# EAGLE design Smart Light Panel (EAGLE 7.5.0)
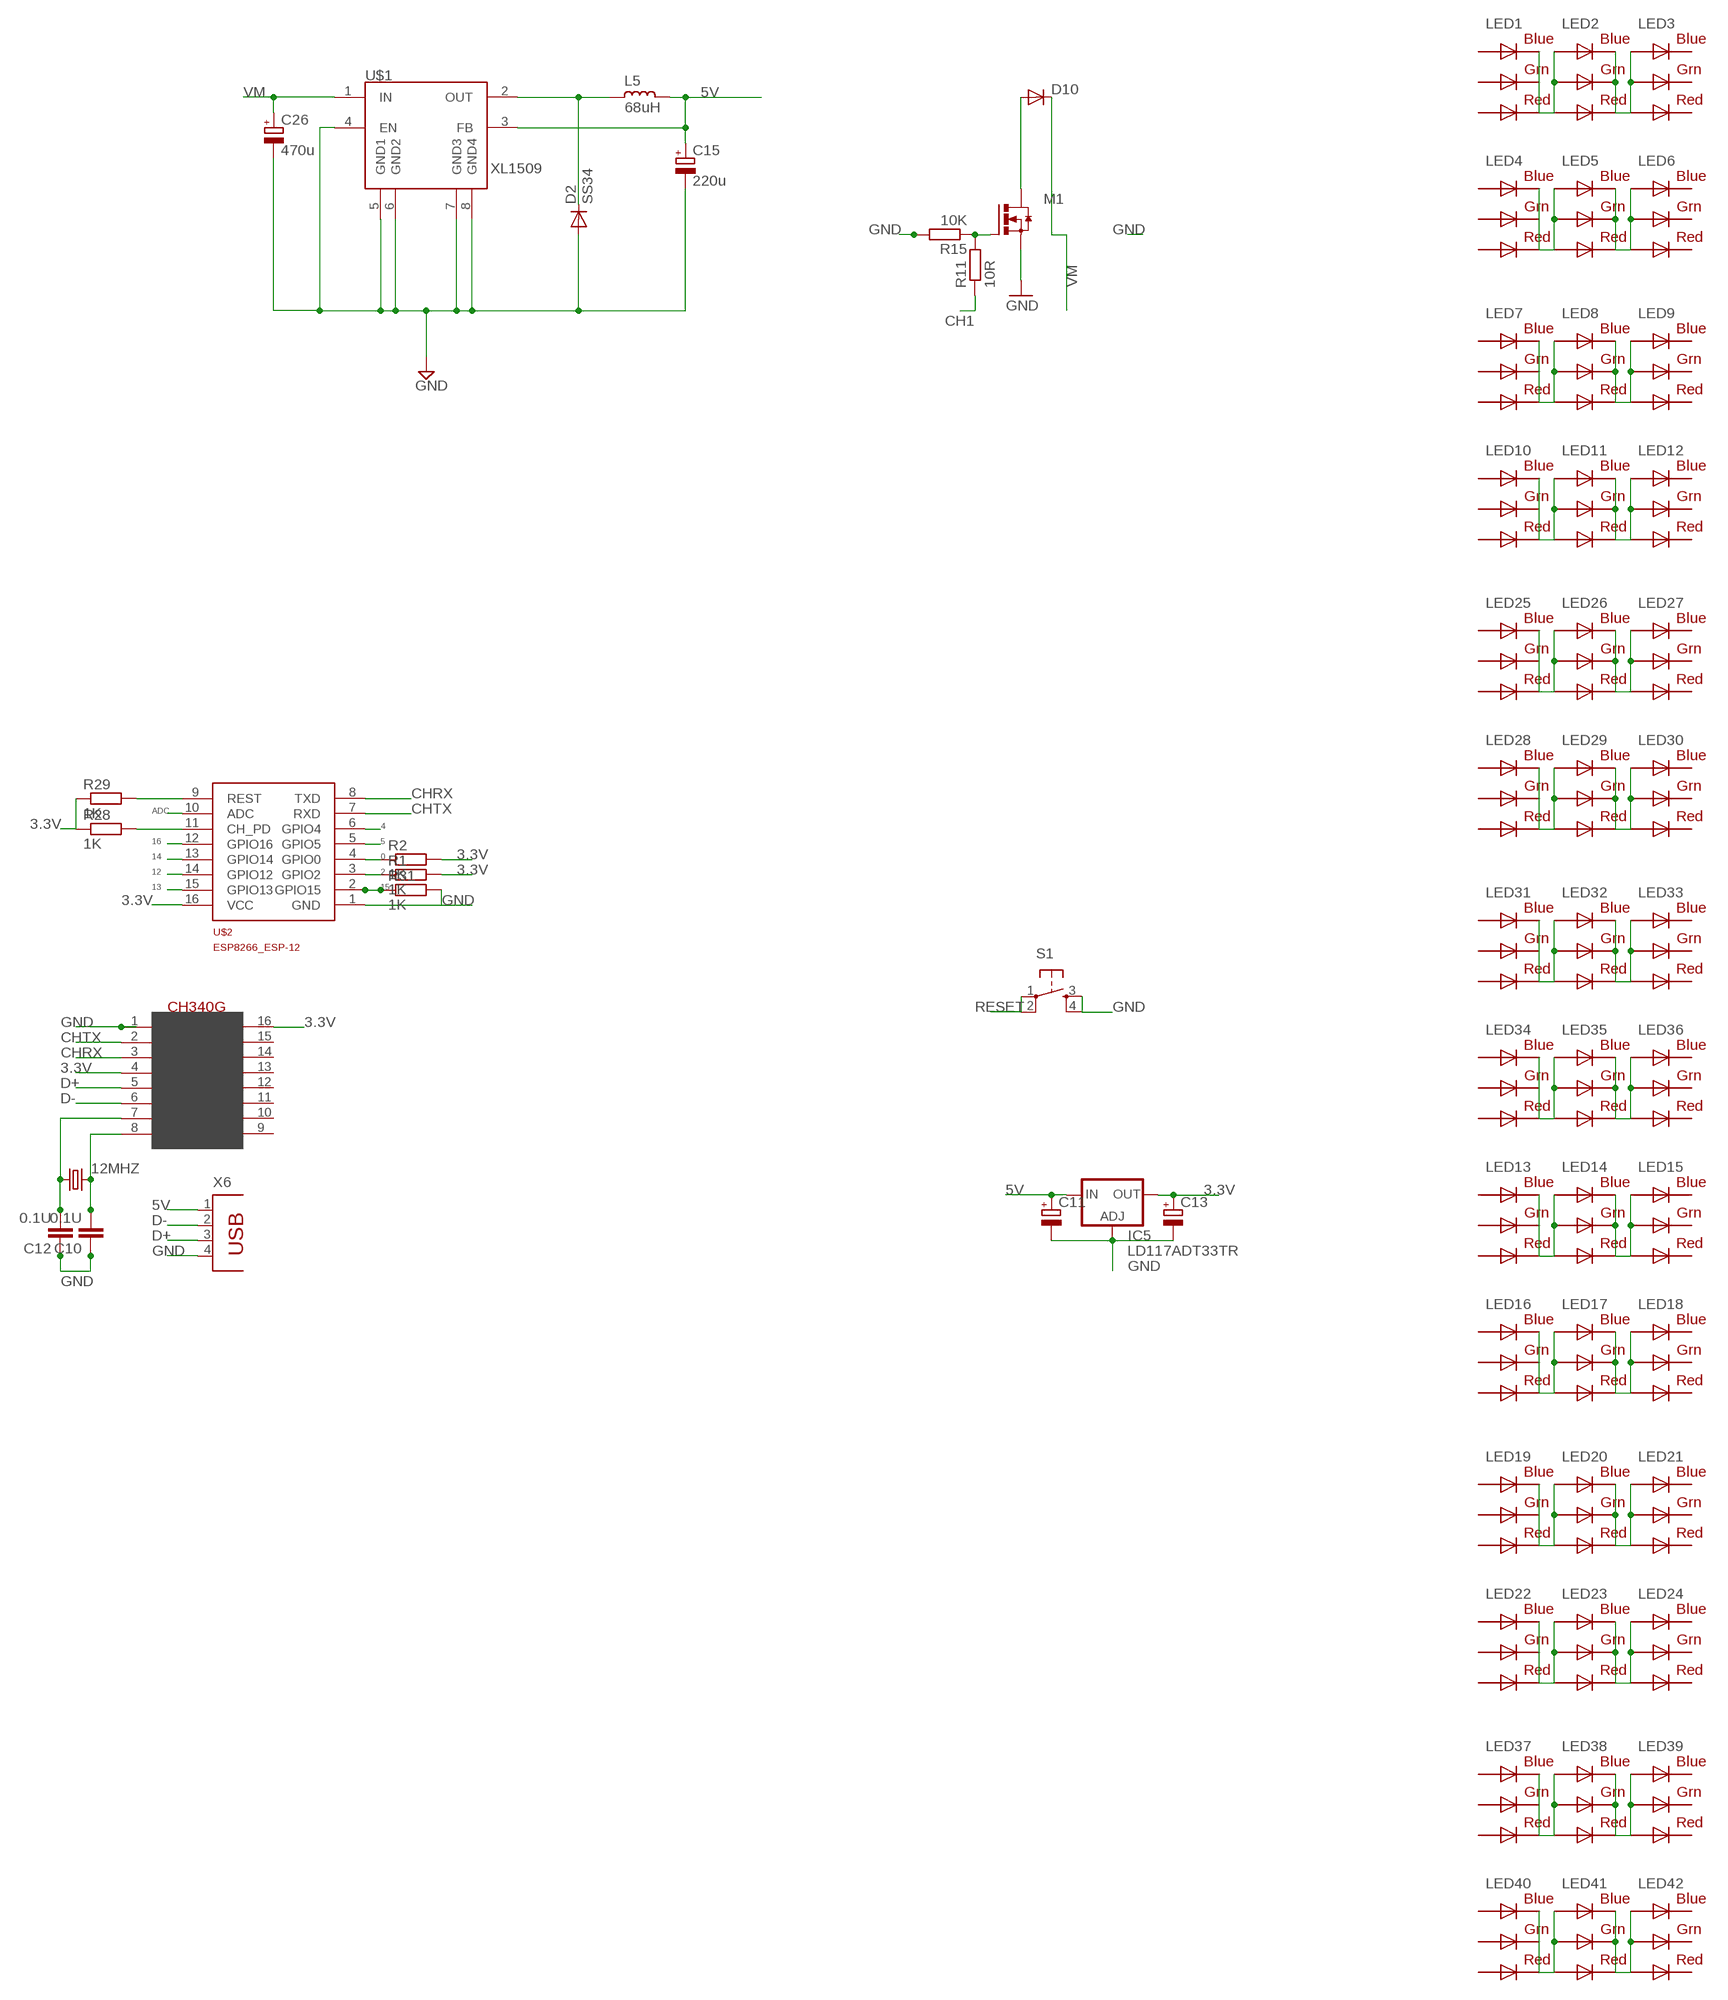
[diagram p0: schematic, sheet 1, part 1 of 2]
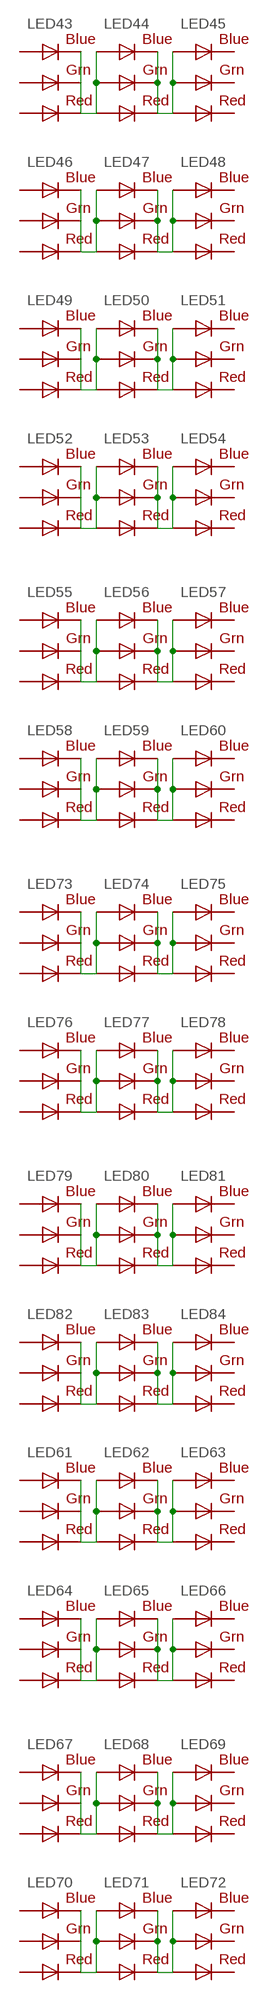
[diagram p1: schematic, sheet 1, part 2 of 2]

## Parts
12MHZ  CRYSTALHC49UP  [HC49UP]
C10  0.1U  C-EUC1206  [C1206]
C11  CPOL-EUC  [PANASONIC_C]
C12  0.1U  C-EUC1206  [C1206]
C13  CPOL-EUC  [PANASONIC_C]
C15  220u  CPOL-EUE2.5-7  [E2,5-7]
C26  470u  CPOL-EUE2.5-7  [E2,5-7]
D2  SS34  DIODE-DO-214AC  [DO-214AC]
D10  DIODESMA-ALT  [SMA-DIODE_ALT]
IC5  LD117ADT33TR  [DPACK]
L5  68uH  L_CD75  [CD75]
LED1  RGBLED5050  [RGBLED5050]
LED2  RGBLED5050  [RGBLED5050]
LED3  RGBLED5050  [RGBLED5050]
LED4  RGBLED5050  [RGBLED5050]
LED5  RGBLED5050  [RGBLED5050]
LED6  RGBLED5050  [RGBLED5050]
LED7  RGBLED5050  [RGBLED5050]
LED8  RGBLED5050  [RGBLED5050]
LED9  RGBLED5050  [RGBLED5050]
LED10  RGBLED5050  [RGBLED5050]
LED11  RGBLED5050  [RGBLED5050]
LED12  RGBLED5050  [RGBLED5050]
LED13  RGBLED5050  [RGBLED5050]
LED14  RGBLED5050  [RGBLED5050]
LED15  RGBLED5050  [RGBLED5050]
LED16  RGBLED5050  [RGBLED5050]
LED17  RGBLED5050  [RGBLED5050]
LED18  RGBLED5050  [RGBLED5050]
LED19  RGBLED5050  [RGBLED5050]
LED20  RGBLED5050  [RGBLED5050]
LED21  RGBLED5050  [RGBLED5050]
LED22  RGBLED5050  [RGBLED5050]
LED23  RGBLED5050  [RGBLED5050]
LED24  RGBLED5050  [RGBLED5050]
LED25  RGBLED5050  [RGBLED5050]
LED26  RGBLED5050  [RGBLED5050]
LED27  RGBLED5050  [RGBLED5050]
LED28  RGBLED5050  [RGBLED5050]
LED29  RGBLED5050  [RGBLED5050]
LED30  RGBLED5050  [RGBLED5050]
LED31  RGBLED5050  [RGBLED5050]
LED32  RGBLED5050  [RGBLED5050]
LED33  RGBLED5050  [RGBLED5050]
LED34  RGBLED5050  [RGBLED5050]
LED35  RGBLED5050  [RGBLED5050]
LED36  RGBLED5050  [RGBLED5050]
LED37  RGBLED5050  [RGBLED5050]
LED38  RGBLED5050  [RGBLED5050]
LED39  RGBLED5050  [RGBLED5050]
LED40  RGBLED5050  [RGBLED5050]
LED41  RGBLED5050  [RGBLED5050]
LED42  RGBLED5050  [RGBLED5050]
LED43  RGBLED5050  [RGBLED5050]
LED44  RGBLED5050  [RGBLED5050]
LED45  RGBLED5050  [RGBLED5050]
LED46  RGBLED5050  [RGBLED5050]
LED47  RGBLED5050  [RGBLED5050]
LED48  RGBLED5050  [RGBLED5050]
LED49  RGBLED5050  [RGBLED5050]
LED50  RGBLED5050  [RGBLED5050]
LED51  RGBLED5050  [RGBLED5050]
LED52  RGBLED5050  [RGBLED5050]
LED53  RGBLED5050  [RGBLED5050]
LED54  RGBLED5050  [RGBLED5050]
LED55  RGBLED5050  [RGBLED5050]
LED56  RGBLED5050  [RGBLED5050]
LED57  RGBLED5050  [RGBLED5050]
LED58  RGBLED5050  [RGBLED5050]
LED59  RGBLED5050  [RGBLED5050]
LED60  RGBLED5050  [RGBLED5050]
LED61  RGBLED5050  [RGBLED5050]
LED62  RGBLED5050  [RGBLED5050]
LED63  RGBLED5050  [RGBLED5050]
LED64  RGBLED5050  [RGBLED5050]
LED65  RGBLED5050  [RGBLED5050]
LED66  RGBLED5050  [RGBLED5050]
LED67  RGBLED5050  [RGBLED5050]
LED68  RGBLED5050  [RGBLED5050]
LED69  RGBLED5050  [RGBLED5050]
LED70  RGBLED5050  [RGBLED5050]
LED71  RGBLED5050  [RGBLED5050]
LED72  RGBLED5050  [RGBLED5050]
LED73  RGBLED5050  [RGBLED5050]
LED74  RGBLED5050  [RGBLED5050]
LED75  RGBLED5050  [RGBLED5050]
LED76  RGBLED5050  [RGBLED5050]
LED77  RGBLED5050  [RGBLED5050]
LED78  RGBLED5050  [RGBLED5050]
LED79  RGBLED5050  [RGBLED5050]
LED80  RGBLED5050  [RGBLED5050]
LED81  RGBLED5050  [RGBLED5050]
LED82  RGBLED5050  [RGBLED5050]
LED83  RGBLED5050  [RGBLED5050]
LED84  RGBLED5050  [RGBLED5050]
M1  IRLR024N  [TO252]
R1  1K  R-EU_M1206  [M1206]
R2  1K  R-EU_M1206  [M1206]
R11  10R  R-EU_M1206  [M1206]
R15  10K  R-EU_M1206  [M1206]
R28  1K  R-EU_M1206  [M1206]
R29  1K  R-EU_M1206  [M1206]
R31  1K  R-EU_M1206  [M1206]
S1  TAC_SWITCHPTH  [TACTILE-PTH]
U$1  XL1509  [SO08]
U$2  ESP8266_ESP-12  [ESP8266-ESP12]
U$4  CH340G  [SOIC16]
X6  PN61729  [PN61729]

## Nets
0: R2.1 U$2.4(GPIO0)
2: R1.1 U$2.3(GPIO2)
3.3V: C13.+ IC5.4(OUT) R1.2 R2.2 R28.1 R29.1 U$2.16(VCC) U$4.4(V3) U$4.16(VCC)
4: U$2.6(GPIO4)
5: U$2.5(GPIO5)
5V: C11.+ C15.+ IC5.3(IN) L5.1 U$1.3(FB) X6.1
12: U$2.14(GPIO12)
13: U$2.15(GPIO13)
14: U$2.13(GPIO14)
15: R31.1 U$2.2(GPIO15)
16: U$2.12(GPIO16)
ADC: U$2.10(ADC)
CH1: R11.1
CHRX: U$2.8(TXD) U$4.3(RX)
CHTX: U$2.7(RXD) U$4.2(TX)
D+: U$4.5(D+) X6.3
D-: U$4.6(D-) X6.2
GND: C10.1 C11.- C12.1 C13.- C15.- C26.- D2.2(A) IC5.1(ADJ) M1.2(S) R15.2 R31.2 S1.3 S1.4 U$1.4(EN) U$1.5(GND1) U$1.6(GND2) U$1.7(GND3) U$1.8(GND4) U$2.1(GND) U$4.1(GND) X6.4
MOSFET: D10.A M1.3(D)
N$2: LED1.4(BLUE_C) LED1.5(RED_C) LED1.6(GREEN_C) LED2.1(GREEN_A) LED2.2(RED_A) LED2.3(BLUE_A)
N$3: LED2.4(BLUE_C) LED2.5(RED_C) LED2.6(GREEN_C) LED3.1(GREEN_A) LED3.2(RED_A) LED3.3(BLUE_A)
N$6: LED4.4(BLUE_C) LED4.5(RED_C) LED4.6(GREEN_C) LED5.1(GREEN_A) LED5.2(RED_A) LED5.3(BLUE_A)
N$7: LED5.4(BLUE_C) LED5.5(RED_C) LED5.6(GREEN_C) LED6.1(GREEN_A) LED6.2(RED_A) LED6.3(BLUE_A)
N$11: LED7.4(BLUE_C) LED7.5(RED_C) LED7.6(GREEN_C) LED8.1(GREEN_A) LED8.2(RED_A) LED8.3(BLUE_A)
N$12: 12MHZ.1 C12.2 U$4.7(XI)
N$13: 12MHZ.2 C10.2 U$4.8(XO)
N$14: LED8.4(BLUE_C) LED8.5(RED_C) LED8.6(GREEN_C) LED9.1(GREEN_A) LED9.2(RED_A) LED9.3(BLUE_A)
N$16: LED10.4(BLUE_C) LED10.5(RED_C) LED10.6(GREEN_C) LED11.1(GREEN_A) LED11.2(RED_A) LED11.3(BLUE_A)
N$17: LED11.4(BLUE_C) LED11.5(RED_C) LED11.6(GREEN_C) LED12.1(GREEN_A) LED12.2(RED_A) LED12.3(BLUE_A)
N$18: R28.2 U$2.11(CH_PD)
N$20: LED13.4(BLUE_C) LED13.5(RED_C) LED13.6(GREEN_C) LED14.1(GREEN_A) LED14.2(RED_A) LED14.3(BLUE_A)
N$21: LED14.4(BLUE_C) LED14.5(RED_C) LED14.6(GREEN_C) LED15.1(GREEN_A) LED15.2(RED_A) LED15.3(BLUE_A)
N$23: LED16.4(BLUE_C) LED16.5(RED_C) LED16.6(GREEN_C) LED17.1(GREEN_A) LED17.2(RED_A) LED17.3(BLUE_A)
N$24: LED17.4(BLUE_C) LED17.5(RED_C) LED17.6(GREEN_C) LED18.1(GREEN_A) LED18.2(RED_A) LED18.3(BLUE_A)
N$26: LED19.4(BLUE_C) LED19.5(RED_C) LED19.6(GREEN_C) LED20.1(GREEN_A) LED20.2(RED_A) LED20.3(BLUE_A)
N$27: LED20.4(BLUE_C) LED20.5(RED_C) LED20.6(GREEN_C) LED21.1(GREEN_A) LED21.2(RED_A) LED21.3(BLUE_A)
N$29: LED22.4(BLUE_C) LED22.5(RED_C) LED22.6(GREEN_C) LED23.1(GREEN_A) LED23.2(RED_A) LED23.3(BLUE_A)
N$30: LED23.4(BLUE_C) LED23.5(RED_C) LED23.6(GREEN_C) LED24.1(GREEN_A) LED24.2(RED_A) LED24.3(BLUE_A)
N$32: LED25.4(BLUE_C) LED25.5(RED_C) LED25.6(GREEN_C) LED26.1(GREEN_A) LED26.2(RED_A) LED26.3(BLUE_A)
N$33: LED26.4(BLUE_C) LED26.5(RED_C) LED26.6(GREEN_C) LED27.1(GREEN_A) LED27.2(RED_A) LED27.3(BLUE_A)
N$35: LED28.4(BLUE_C) LED28.5(RED_C) LED28.6(GREEN_C) LED29.1(GREEN_A) LED29.2(RED_A) LED29.3(BLUE_A)
N$36: LED29.4(BLUE_C) LED29.5(RED_C) LED29.6(GREEN_C) LED30.1(GREEN_A) LED30.2(RED_A) LED30.3(BLUE_A)
N$38: LED31.4(BLUE_C) LED31.5(RED_C) LED31.6(GREEN_C) LED32.1(GREEN_A) LED32.2(RED_A) LED32.3(BLUE_A)
N$39: LED32.4(BLUE_C) LED32.5(RED_C) LED32.6(GREEN_C) LED33.1(GREEN_A) LED33.2(RED_A) LED33.3(BLUE_A)
N$41: LED34.4(BLUE_C) LED34.5(RED_C) LED34.6(GREEN_C) LED35.1(GREEN_A) LED35.2(RED_A) LED35.3(BLUE_A)
N$42: LED35.4(BLUE_C) LED35.5(RED_C) LED35.6(GREEN_C) LED36.1(GREEN_A) LED36.2(RED_A) LED36.3(BLUE_A)
N$44: LED37.4(BLUE_C) LED37.5(RED_C) LED37.6(GREEN_C) LED38.1(GREEN_A) LED38.2(RED_A) LED38.3(BLUE_A)
N$45: LED38.4(BLUE_C) LED38.5(RED_C) LED38.6(GREEN_C) LED39.1(GREEN_A) LED39.2(RED_A) LED39.3(BLUE_A)
N$47: LED40.4(BLUE_C) LED40.5(RED_C) LED40.6(GREEN_C) LED41.1(GREEN_A) LED41.2(RED_A) LED41.3(BLUE_A)
N$48: LED41.4(BLUE_C) LED41.5(RED_C) LED41.6(GREEN_C) LED42.1(GREEN_A) LED42.2(RED_A) LED42.3(BLUE_A)
N$50: LED43.4(BLUE_C) LED43.5(RED_C) LED43.6(GREEN_C) LED44.1(GREEN_A) LED44.2(RED_A) LED44.3(BLUE_A)
N$51: LED44.4(BLUE_C) LED44.5(RED_C) LED44.6(GREEN_C) LED45.1(GREEN_A) LED45.2(RED_A) LED45.3(BLUE_A)
N$53: LED46.4(BLUE_C) LED46.5(RED_C) LED46.6(GREEN_C) LED47.1(GREEN_A) LED47.2(RED_A) LED47.3(BLUE_A)
N$54: LED47.4(BLUE_C) LED47.5(RED_C) LED47.6(GREEN_C) LED48.1(GREEN_A) LED48.2(RED_A) LED48.3(BLUE_A)
N$56: LED49.4(BLUE_C) LED49.5(RED_C) LED49.6(GREEN_C) LED50.1(GREEN_A) LED50.2(RED_A) LED50.3(BLUE_A)
N$57: LED50.4(BLUE_C) LED50.5(RED_C) LED50.6(GREEN_C) LED51.1(GREEN_A) LED51.2(RED_A) LED51.3(BLUE_A)
N$59: LED52.4(BLUE_C) LED52.5(RED_C) LED52.6(GREEN_C) LED53.1(GREEN_A) LED53.2(RED_A) LED53.3(BLUE_A)
N$60: LED53.4(BLUE_C) LED53.5(RED_C) LED53.6(GREEN_C) LED54.1(GREEN_A) LED54.2(RED_A) LED54.3(BLUE_A)
N$62: LED55.4(BLUE_C) LED55.5(RED_C) LED55.6(GREEN_C) LED56.1(GREEN_A) LED56.2(RED_A) LED56.3(BLUE_A)
N$63: LED56.4(BLUE_C) LED56.5(RED_C) LED56.6(GREEN_C) LED57.1(GREEN_A) LED57.2(RED_A) LED57.3(BLUE_A)
N$65: LED58.4(BLUE_C) LED58.5(RED_C) LED58.6(GREEN_C) LED59.1(GREEN_A) LED59.2(RED_A) LED59.3(BLUE_A)
N$66: LED59.4(BLUE_C) LED59.5(RED_C) LED59.6(GREEN_C) LED60.1(GREEN_A) LED60.2(RED_A) LED60.3(BLUE_A)
N$67: M1.1(G) R11.2 R15.1
N$69: LED61.4(BLUE_C) LED61.5(RED_C) LED61.6(GREEN_C) LED62.1(GREEN_A) LED62.2(RED_A) LED62.3(BLUE_A)
N$70: LED62.4(BLUE_C) LED62.5(RED_C) LED62.6(GREEN_C) LED63.1(GREEN_A) LED63.2(RED_A) LED63.3(BLUE_A)
N$72: LED64.4(BLUE_C) LED64.5(RED_C) LED64.6(GREEN_C) LED65.1(GREEN_A) LED65.2(RED_A) LED65.3(BLUE_A)
N$73: LED65.4(BLUE_C) LED65.5(RED_C) LED65.6(GREEN_C) LED66.1(GREEN_A) LED66.2(RED_A) LED66.3(BLUE_A)
N$75: LED67.4(BLUE_C) LED67.5(RED_C) LED67.6(GREEN_C) LED68.1(GREEN_A) LED68.2(RED_A) LED68.3(BLUE_A)
N$76: LED68.4(BLUE_C) LED68.5(RED_C) LED68.6(GREEN_C) LED69.1(GREEN_A) LED69.2(RED_A) LED69.3(BLUE_A)
N$78: LED70.4(BLUE_C) LED70.5(RED_C) LED70.6(GREEN_C) LED71.1(GREEN_A) LED71.2(RED_A) LED71.3(BLUE_A)
N$79: LED71.4(BLUE_C) LED71.5(RED_C) LED71.6(GREEN_C) LED72.1(GREEN_A) LED72.2(RED_A) LED72.3(BLUE_A)
N$81: LED73.4(BLUE_C) LED73.5(RED_C) LED73.6(GREEN_C) LED74.1(GREEN_A) LED74.2(RED_A) LED74.3(BLUE_A)
N$82: LED74.4(BLUE_C) LED74.5(RED_C) LED74.6(GREEN_C) LED75.1(GREEN_A) LED75.2(RED_A) LED75.3(BLUE_A)
N$84: LED76.4(BLUE_C) LED76.5(RED_C) LED76.6(GREEN_C) LED77.1(GREEN_A) LED77.2(RED_A) LED77.3(BLUE_A)
N$85: LED77.4(BLUE_C) LED77.5(RED_C) LED77.6(GREEN_C) LED78.1(GREEN_A) LED78.2(RED_A) LED78.3(BLUE_A)
N$87: LED79.4(BLUE_C) LED79.5(RED_C) LED79.6(GREEN_C) LED80.1(GREEN_A) LED80.2(RED_A) LED80.3(BLUE_A)
N$88: LED80.4(BLUE_C) LED80.5(RED_C) LED80.6(GREEN_C) LED81.1(GREEN_A) LED81.2(RED_A) LED81.3(BLUE_A)
N$90: LED82.4(BLUE_C) LED82.5(RED_C) LED82.6(GREEN_C) LED83.1(GREEN_A) LED83.2(RED_A) LED83.3(BLUE_A)
N$91: LED83.4(BLUE_C) LED83.5(RED_C) LED83.6(GREEN_C) LED84.1(GREEN_A) LED84.2(RED_A) LED84.3(BLUE_A)
N$92: D2.1(C) L5.2 U$1.2(OUT)
RESET: R29.2 S1.1 S1.2 U$2.9(REST)
VM: C26.+ D10.C U$1.1(IN)
Unconnected: LED1.1(GREEN_A) LED1.2(RED_A) LED1.3(BLUE_A) LED3.4(BLUE_C) LED3.5(RED_C) LED3.6(GREEN_C) LED4.1(GREEN_A) LED4.2(RED_A) LED4.3(BLUE_A) LED6.4(BLUE_C) LED6.5(RED_C) LED6.6(GREEN_C) LED7.1(GREEN_A) LED7.2(RED_A) LED7.3(BLUE_A) LED9.4(BLUE_C) LED9.5(RED_C) LED9.6(GREEN_C) LED10.1(GREEN_A) LED10.2(RED_A) LED10.3(BLUE_A) LED12.4(BLUE_C) LED12.5(RED_C) LED12.6(GREEN_C) LED13.1(GREEN_A) LED13.2(RED_A) LED13.3(BLUE_A) LED15.4(BLUE_C) LED15.5(RED_C) LED15.6(GREEN_C) LED16.1(GREEN_A) LED16.2(RED_A) LED16.3(BLUE_A) LED18.4(BLUE_C) LED18.5(RED_C) LED18.6(GREEN_C) LED19.1(GREEN_A) LED19.2(RED_A) LED19.3(BLUE_A) LED21.4(BLUE_C) LED21.5(RED_C) LED21.6(GREEN_C) LED22.1(GREEN_A) LED22.2(RED_A) LED22.3(BLUE_A) LED24.4(BLUE_C) LED24.5(RED_C) LED24.6(GREEN_C) LED25.1(GREEN_A) LED25.2(RED_A) LED25.3(BLUE_A) LED27.4(BLUE_C) LED27.5(RED_C) LED27.6(GREEN_C) LED28.1(GREEN_A) LED28.2(RED_A) LED28.3(BLUE_A) LED30.4(BLUE_C) LED30.5(RED_C) LED30.6(GREEN_C) LED31.1(GREEN_A) LED31.2(RED_A) LED31.3(BLUE_A) LED33.4(BLUE_C) LED33.5(RED_C) LED33.6(GREEN_C) LED34.1(GREEN_A) LED34.2(RED_A) LED34.3(BLUE_A) LED36.4(BLUE_C) LED36.5(RED_C) LED36.6(GREEN_C) LED37.1(GREEN_A) LED37.2(RED_A) LED37.3(BLUE_A) LED39.4(BLUE_C) LED39.5(RED_C) LED39.6(GREEN_C) LED40.1(GREEN_A) LED40.2(RED_A) LED40.3(BLUE_A) LED42.4(BLUE_C) LED42.5(RED_C) LED42.6(GREEN_C) LED43.1(GREEN_A) LED43.2(RED_A) LED43.3(BLUE_A) LED45.4(BLUE_C) LED45.5(RED_C) LED45.6(GREEN_C) LED46.1(GREEN_A) LED46.2(RED_A) LED46.3(BLUE_A) LED48.4(BLUE_C) LED48.5(RED_C) LED48.6(GREEN_C) LED49.1(GREEN_A) LED49.2(RED_A) LED49.3(BLUE_A) LED51.4(BLUE_C) LED51.5(RED_C) LED51.6(GREEN_C) LED52.1(GREEN_A) LED52.2(RED_A) LED52.3(BLUE_A) LED54.4(BLUE_C) LED54.5(RED_C) LED54.6(GREEN_C) LED55.1(GREEN_A) LED55.2(RED_A) LED55.3(BLUE_A) LED57.4(BLUE_C) LED57.5(RED_C) LED57.6(GREEN_C) LED58.1(GREEN_A) LED58.2(RED_A) LED58.3(BLUE_A) LED60.4(BLUE_C) LED60.5(RED_C) LED60.6(GREEN_C) LED61.1(GREEN_A) LED61.2(RED_A) LED61.3(BLUE_A) LED63.4(BLUE_C) LED63.5(RED_C) LED63.6(GREEN_C) LED64.1(GREEN_A) LED64.2(RED_A) LED64.3(BLUE_A) LED66.4(BLUE_C) LED66.5(RED_C) LED66.6(GREEN_C) LED67.1(GREEN_A) LED67.2(RED_A) LED67.3(BLUE_A) LED69.4(BLUE_C) LED69.5(RED_C) LED69.6(GREEN_C) LED70.1(GREEN_A) LED70.2(RED_A) LED70.3(BLUE_A) LED72.4(BLUE_C) LED72.5(RED_C) LED72.6(GREEN_C) LED73.1(GREEN_A) LED73.2(RED_A) LED73.3(BLUE_A) LED75.4(BLUE_C) LED75.5(RED_C) LED75.6(GREEN_C) LED76.1(GREEN_A) LED76.2(RED_A) LED76.3(BLUE_A) LED78.4(BLUE_C) LED78.5(RED_C) LED78.6(GREEN_C) LED79.1(GREEN_A) LED79.2(RED_A) LED79.3(BLUE_A) LED81.4(BLUE_C) LED81.5(RED_C) LED81.6(GREEN_C) LED82.1(GREEN_A) LED82.2(RED_A) LED82.3(BLUE_A) LED84.4(BLUE_C) LED84.5(RED_C) LED84.6(GREEN_C) U$4.9(CTS) U$4.10(DSR) U$4.11(RI) U$4.12(DCD) U$4.13(DTR) U$4.14(RTS) U$4.15(RS232)

## Library data of the parts
12MHZ = crystal:CRYSTAL: CRYSTAL; OC_FARNELL: unknown; OC_NEWARK: unknown
C10 C12 = rcl:C-EU: CAPACITOR, European symbol
C11 C13 C15 C26 = rcl:CPOL-EU: POLARIZED CAPACITOR, European symbol
D2 = dp_devices:DIODE: Various Diode Packages
D10 = SparkFun-DiscreteSemi:DIODE: Diode These are standard reverse protection diodes and small signal diodes. SMA package can handle up to about 1A. SOD-323 can handle about 200mA. What the SOD-323 package when ordering, there are some mfgs out there that are 5-pin packages.
IC5 = v-reg:LD117A?*: Low drop fixed and adjustable positive voltage regulators 1 A Source: http://www.st.com/stonline/products/literature/ds/7194/ld1117axx.pdf
L5 = rc-master-smd:L_: INDUCTOR
LED1-LED84 = adafruit:RGBLED: For 5050 RGB LEDs, the order of the LEDs may vary from one manufacturer to another!
M1 = to252(1):IRLR024N
R1 R2 R28 R29 R31 = rcl:R-EU_: RESISTOR, European symbol
R11 R15 = resistor:R-EU_: RESISTOR, European symbol
S1 = SparkFun:TAC_SWITCH: Momentary Switch Button commonly used for reset or general input. Spark Fun Electronics SKU : COM-00097
U$1 = Cohesion_parts:XL1509
U$2 = ESP8266-ESP12:ESP8266_ESP-12: ESP8266 ESP-12 Discussion about pins here: http://www.esp8266.com/viewtopic.php?f=13&t=1429
U$4 = usb-serial:CH340G
X6 = con-berg:PN61729: BERG USB connector; OC_FARNELL: unknown; OC_NEWARK: unknown

## Net classes
1 power: width 0.6 mm, clearance 0.305 mm

## Board
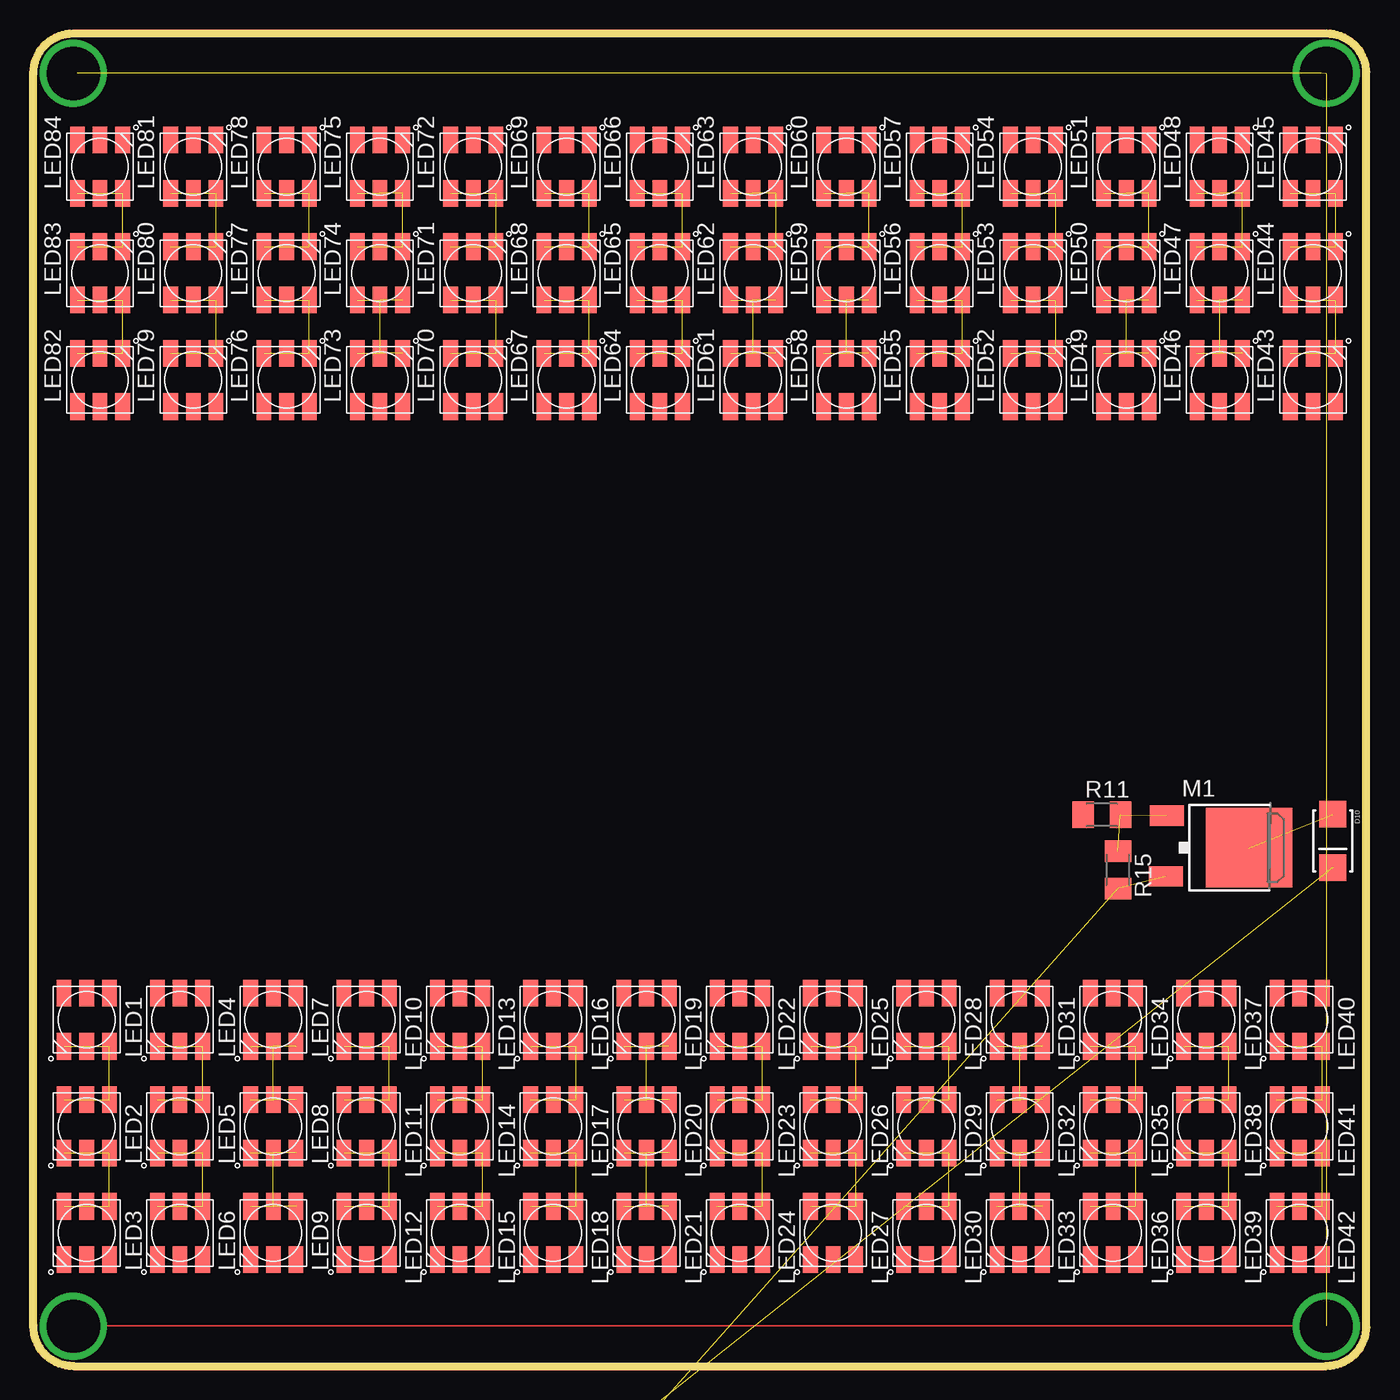
[diagram p2: board, top side]
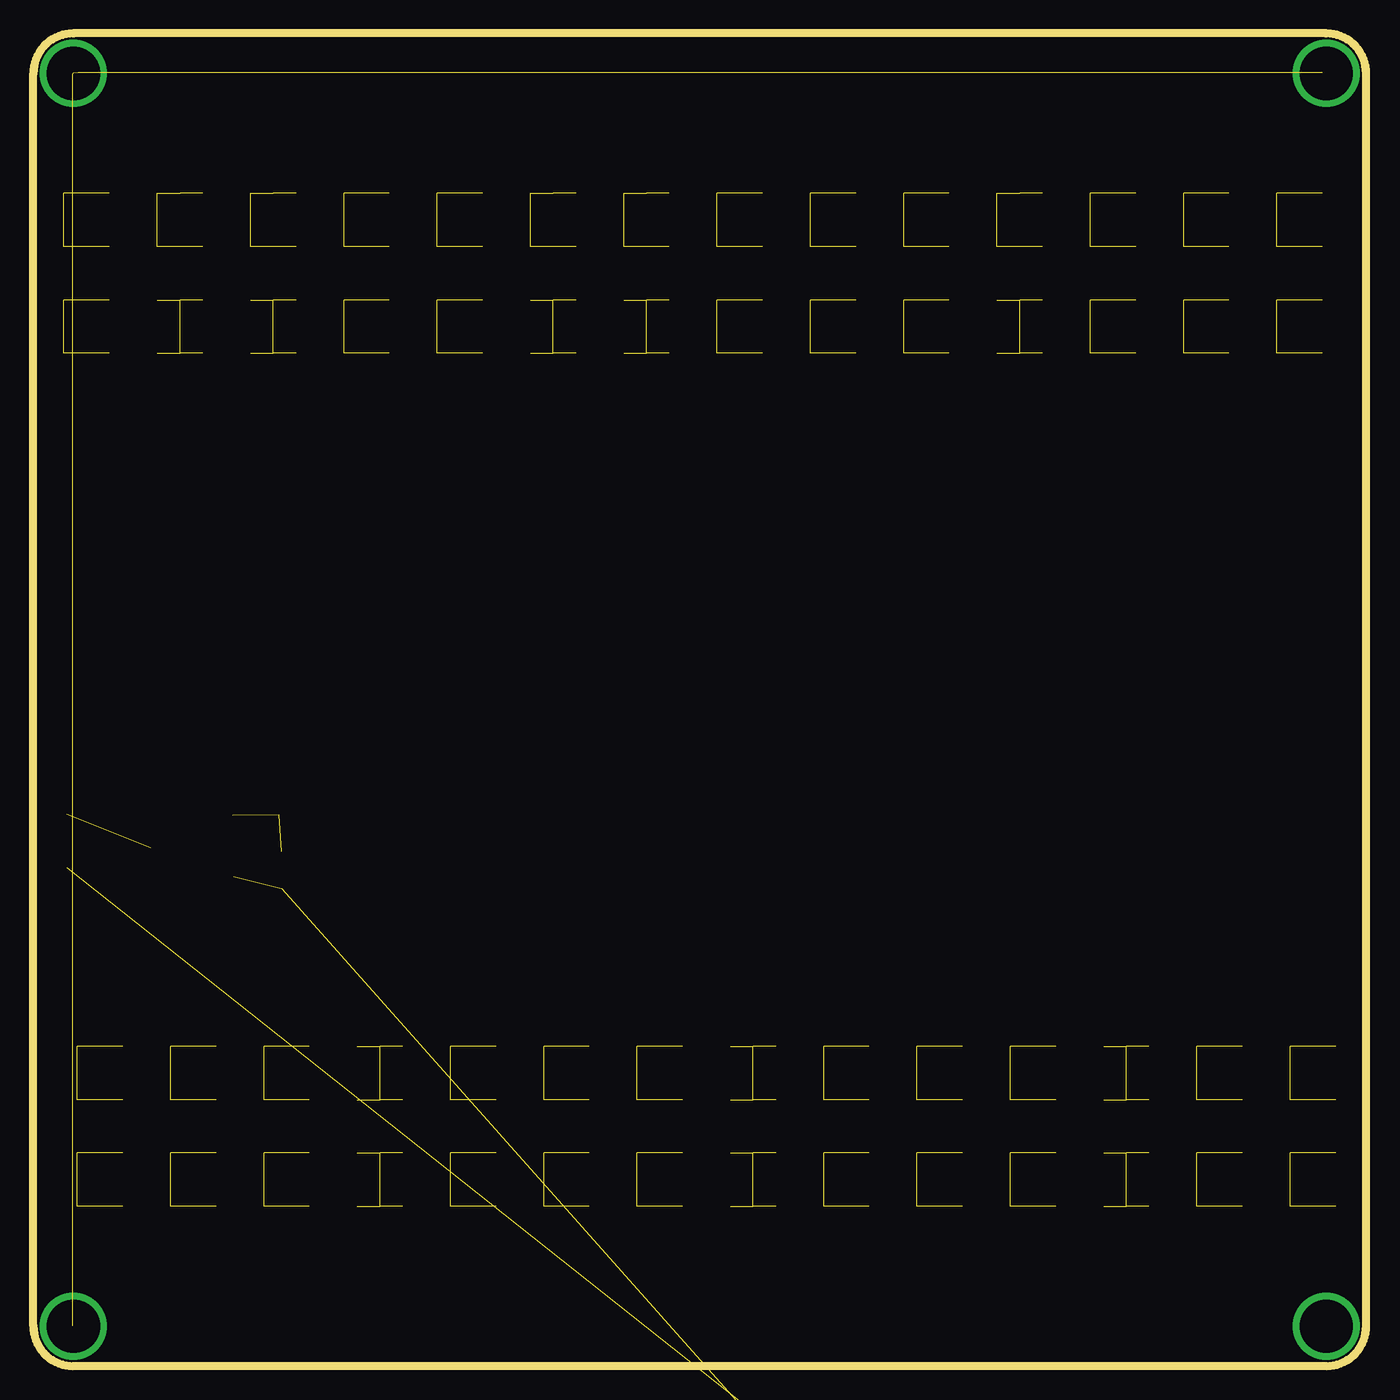
[diagram p3: board, bottom side, seen from below]

Size 100 x 100 mm. Coordinates in mm from the lower left corner, seen from the top.
Outline: 0,3 0,97 arc-90 3,100 97,100 arc-90 100,97 100,3 arc-90 97,0 3,0 arc-90 0,3
Copper layers (1*16): Top 0.035mm / dielectric 1.5mm / Bottom 0.035mm
Design rules "dirt_cheap_dirty_boards.v1": minimum track width 5mil, minimum drill 12mil, track to track 5mil, track to pad 5mil, pad to pad 5mil, via to via 5mil, smd to smd 0mil, copper to edge 10mil, drill to drill 10mil, minimum pad ring 10mil, minimum via ring 6mil, stop-mask expansion 2mil, vias tented up to drill 25mil, thermal gap 10mil

### Footprints (pad centres in the part's own frame; a part is rotated, then mirrored left to right if it is on the bottom)
HC49UP = smd 5.334 x 1.93: 1 -4.826,0; 2 4.826,0
C1206 = smd 1.6 x 1.8: 1 -1.4,0; 2 1.4,0
PANASONIC_C = smd 2.6 x 1.4: + 2.05,0; - -2.05,0
E2,5-7 = drill 0.813 pad 1.6: + -1.27,0 | drill 0.813 pad 1.6 octagon: - 1.27,0
DO-214AC = smd 1.27 x 2.1: 1 -1.98,0; 2 1.98,0
SMA-DIODE_ALT = smd 2 x 2: A -2,0; C 2,0
DPACK = smd 1.6 x 3: 1 -2.28,-4.8; 3 2.28,-4.8 | smd 5.8 x 6.2: 4 0,2.38
CD75 = smd 7 x 2.85: 1 0,2.54; 2 0,-2.54
RGBLED5050 = smd 2 x 1.1: 1 -2,1.7; 2 -2,0; 3 -2,-1.7; 4 2,-1.7; 5 2,0; 6 2,1.7
TO252 = smd 1.524 x 2.54: 1 -2.407,-3.657; 2 2.153,-3.72 | smd 5.97 x 6.48: 3 0,2.5
M1206 = smd 1.6 x 2: 1 -1.4,0; 2 1.4,0
TACTILE-PTH = drill 1.016 pad 1.88: 1 -3.251,2.261; 2 3.251,2.261; 3 -3.251,-2.261; 4 3.251,-2.261
SO08 = smd 0.61 x 2.21: 1 -1.905,-2.616; 2 -0.635,-2.616; 3 0.635,-2.616; 4 1.905,-2.616; 5 1.905,2.616; 6 0.635,2.616; 7 -0.635,2.616; 8 -1.905,2.616
ESP8266-ESP12 = smd 2 x 1.2: 1 16.2,2; 2 16.2,4; 3 16.2,6; 4 16.2,8; 5 16.2,10; 6 16.2,12; 7 16.2,14; 8 16.2,16; 9 0,16; 10 0,14; 11 0,12; 12 0,10; 13 0,8; 14 0,6; 15 0,4; 16 0,2
SOIC16 = smd 0.635 x 1.524: 1 -4.445,-2.695; 2 -3.175,-2.695; 3 -1.905,-2.695; 4 -0.635,-2.695; 5 0.635,-2.695; 6 1.905,-2.695; 7 3.175,-2.695; 8 4.445,-2.695; 9 4.445,2.695; 10 3.175,2.695; 11 1.905,2.695; 12 0.635,2.695; 13 -0.635,2.695; 14 -1.905,2.695; 15 -3.175,2.695; 16 -4.445,2.695
PN61729 = drill 0.95 octagon: 1 1.25,4.71; 2 -1.25,4.71; 3 -1.25,2.71; 4 1.25,2.71 | hole 2.3: -6.02,0; 6.02,0

### Placement (x,y rotation side)
12MHZ  6.73,-46.39 0 top  (outside the outline)
C10  11.24,-41.58 180 top  (outside the outline)
C11  -5.31,-29.93 90 top  (outside the outline)
C12  3.81,-41.62 180 top  (outside the outline)
C13  -16.67,-31.93 90 top  (outside the outline)
C15  -63,-89 0 top  (outside the outline)
C26  -63,-97 0 top  (outside the outline)
D2  -52,-97 0 top  (outside the outline)
D10  97.49,39.41 270 top
IC5  -11.47,-31.21 90 top  (outside the outline)
L5  -61,-80 0 top  (outside the outline)
LED1  4,26 270 top
LED2  4,18 270 top
LED3  4,10 270 top
LED4  11,26 270 top
LED5  11,18 270 top
LED6  11,10 270 top
LED7  18,26 270 top
LED8  18,18 270 top
LED9  18,10 270 top
LED10  25,26 270 top
LED11  25,18 270 top
LED12  25,10 270 top
LED13  32,26 270 top
LED14  32,18 270 top
LED15  32,10 270 top
LED16  39,26 270 top
LED17  39,18 270 top
LED18  39,10 270 top
LED19  46,26 270 top
LED20  46,18 270 top
LED21  46,10 270 top
LED22  53,26 270 top
LED23  53,18 270 top
LED24  53,10 270 top
LED25  60,26 270 top
LED26  60,18 270 top
LED27  60,10 270 top
LED28  67,26 270 top
LED29  67,18 270 top
LED30  67,10 270 top
LED31  74,26 270 top
LED32  74,18 270 top
LED33  74,10 270 top
LED34  81,26 270 top
LED35  81,18 270 top
LED36  81,10 270 top
LED37  88,26 270 top
LED38  88,18 270 top
LED39  88,10 270 top
LED40  95,26 270 top
LED41  95,18 270 top
LED42  95,10 270 top
LED43  96,74 90 top
LED44  96,82 90 top
LED45  96,90 90 top
LED46  89,74 90 top
LED47  89,82 90 top
LED48  89,90 90 top
LED49  82,74 90 top
LED50  82,82 90 top
LED51  82,90 90 top
LED52  75,74 90 top
LED53  75,82 90 top
LED54  75,90 90 top
LED55  68,74 90 top
LED56  68,82 90 top
LED57  68,90 90 top
LED58  61,74 90 top
LED59  61,82 90 top
LED60  61,90 90 top
LED61  54,74 90 top
LED62  54,82 90 top
LED63  54,90 90 top
LED64  47,74 90 top
LED65  47,82 90 top
LED66  47,90 90 top
LED67  40,74 90 top
LED68  40,82 90 top
LED69  40,90 90 top
LED70  33,74 90 top
LED71  33,82 90 top
LED72  33,90 90 top
LED73  26,74 90 top
LED74  26,82 90 top
LED75  26,90 90 top
LED76  19,74 90 top
LED77  19,82 90 top
LED78  19,90 90 top
LED79  12,74 90 top
LED80  12,82 90 top
LED81  12,90 90 top
LED82  5,74 90 top
LED83  5,82 90 top
LED84  5,90 90 top
M1  88.7,38.9 270 top
R1  -40.19,-53.3 0 top  (outside the outline)
R2  -40.14,-56.48 0 top  (outside the outline)
R11  80.17,41.36 0 top
R15  81.38,37.23 270 top
R28  -40.1,-63.23 180 top  (outside the outline)
R29  -40.1,-59.76 180 top  (outside the outline)
R31  -40.2,-49.96 180 top  (outside the outline)
S1  -27.57,-59.81 180 top  (outside the outline)
U$1  -52,-80 0 top  (outside the outline)
U$2  -42.96,-64.69 90 top  (outside the outline)
U$4  4.53,-55.41 90 top  (outside the outline)
X6  17.97,-56.07 90 top  (outside the outline)

### Tracks (layer width: path | path; a pad name or v marks a point on that pad's centre or on a via)
0  (1 unrouted)
2  (1 unrouted)
3.3V  (8 unrouted)
5V  (5 unrouted)
15  (1 unrouted)
CHRX  (1 unrouted)
CHTX  (1 unrouted)
D+  (1 unrouted)
D-  (1 unrouted)
GND  (20 unrouted)
MOSFET  (1 unrouted)
N$2  (5 unrouted)
N$3  (5 unrouted)
N$6  (5 unrouted)
N$7  (5 unrouted)
N$9  (via drill 4)  (4 unrouted)
  Top 0.127: 3.3,97.03 v3,97 | v3,3 3.05,3.05 96.9,3.05 v97,3
  Top 0.61: 3.05,97.03 v3,97
  Bottom 0.127: 97.03,3.05 v97,3
  other vias: 97,97
N$11  (5 unrouted)
N$12  (2 unrouted)
N$13  (2 unrouted)
N$14  (5 unrouted)
N$16  (5 unrouted)
N$17  (5 unrouted)
N$18  (1 unrouted)
N$20  (5 unrouted)
N$21  (5 unrouted)
N$23  (5 unrouted)
N$24  (5 unrouted)
N$26  (5 unrouted)
N$27  (5 unrouted)
N$29  (5 unrouted)
N$30  (5 unrouted)
N$32  (5 unrouted)
N$33  (5 unrouted)
N$35  (5 unrouted)
N$36  (5 unrouted)
N$38  (5 unrouted)
N$39  (5 unrouted)
N$41  (5 unrouted)
N$42  (5 unrouted)
N$44  (5 unrouted)
N$45  (5 unrouted)
N$47  (5 unrouted)
N$48  (5 unrouted)
N$50  (5 unrouted)
N$51  (5 unrouted)
N$53  (5 unrouted)
N$54  (5 unrouted)
N$56  (5 unrouted)
N$57  (5 unrouted)
N$59  (5 unrouted)
N$60  (5 unrouted)
N$62  (5 unrouted)
N$63  (5 unrouted)
N$65  (5 unrouted)
N$66  (5 unrouted)
N$67  (2 unrouted)
N$69  (5 unrouted)
N$70  (5 unrouted)
N$72  (5 unrouted)
N$73  (5 unrouted)
N$75  (5 unrouted)
N$76  (5 unrouted)
N$78  (5 unrouted)
N$79  (5 unrouted)
N$81  (5 unrouted)
N$82  (5 unrouted)
N$84  (5 unrouted)
N$85  (5 unrouted)
N$87  (5 unrouted)
N$88  (5 unrouted)
N$90  (5 unrouted)
N$91  (5 unrouted)
N$92  (2 unrouted)
RESET  (3 unrouted)
VM  (2 unrouted)